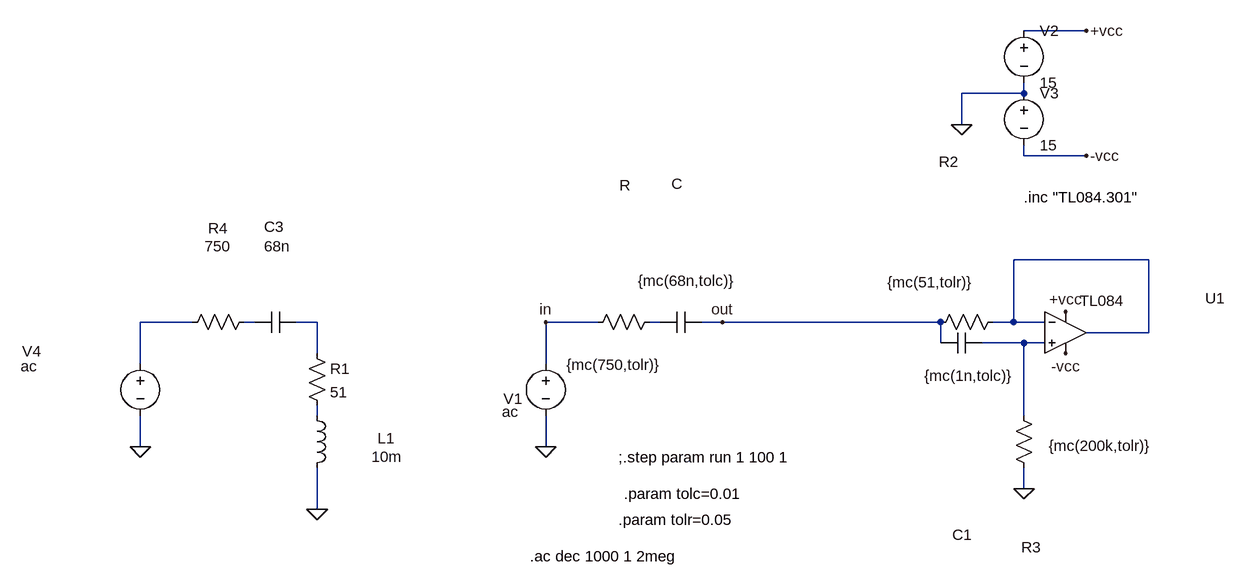
[diagram p0: schematic HP.asc]
HP.asc, the LTspice schematic file:
Version 4
SHEET 1 1036 680
WIRE 816 -368 720 -368
WIRE 720 -272 720 -288
WIRE 720 -272 624 -272
WIRE 624 -224 624 -272
WIRE 720 -176 720 -192
WIRE 816 -176 720 -176
WIRE 912 -16 704 -16
WIRE -560 80 -640 80
WIRE -464 80 -480 80
WIRE -368 80 -400 80
WIRE 64 80 -16 80
WIRE 160 80 144 80
WIRE 256 80 224 80
WIRE 592 80 256 80
WIRE 704 80 704 -16
WIRE 704 80 672 80
WIRE 752 80 704 80
WIRE 912 96 912 -16
WIRE 912 96 816 96
WIRE 592 112 592 80
WIRE 720 112 656 112
WIRE 752 112 720 112
WIRE -368 128 -368 80
WIRE -640 144 -640 80
WIRE -16 144 -16 80
WIRE -368 224 -368 208
WIRE 720 224 720 112
WIRE -640 272 -640 224
WIRE -16 272 -16 224
WIRE 720 336 720 304
WIRE -368 368 -368 304
FLAG -16 272 0
FLAG 816 -368 +vcc
FLAG 784 64 +vcc
FLAG 816 -176 -vcc
FLAG 784 128 -vcc
FLAG 624 -224 0
FLAG -16 80 in
FLAG 256 80 out
FLAG 720 336 0
FLAG -640 272 0
FLAG -368 368 0
SYMBOL Opamps\\opamp2 784 32 R0
WINDOW 0 215 11 Left 2
WINDOW 3 22 15 Left 2
SYMATTR InstName U1
SYMATTR Value TL084
SYMBOL voltage 720 -384 R0
SYMATTR InstName V2
SYMATTR Value 15
SYMBOL voltage 720 -288 R0
SYMATTR InstName V3
SYMATTR Value 15
SYMBOL voltage -16 128 R0
WINDOW 123 0 0 Left 0
WINDOW 39 0 0 Left 0
WINDOW 0 -65 70 Left 2
WINDOW 3 -67 90 Left 2
SYMATTR InstName V1
SYMATTR Value ac
SYMBOL res 160 64 R90
WINDOW 0 -179 54 VBottom 2
WINDOW 3 66 71 VTop 2
SYMATTR InstName R
SYMATTR Value {mc(750,tolr)}
SYMBOL cap 656 96 R90
WINDOW 0 327 31 VBottom 2
WINDOW 3 51 21 VTop 2
SYMATTR InstName C1
SYMATTR Value {mc(1n,tolc)}
SYMBOL res 688 64 R90
WINDOW 0 -215 84 VBottom 2
WINDOW 3 -61 112 VTop 2
SYMATTR InstName R2
SYMATTR Value {mc(51,tolr)}
SYMBOL res 704 208 R0
WINDOW 0 12 218 Left 2
WINDOW 3 54 62 Left 2
SYMATTR InstName R3
SYMATTR Value {mc(200k,tolr)}
SYMBOL cap 160 64 M90
WINDOW 0 -181 26 VBottom 2
WINDOW 3 -63 41 VTop 2
SYMATTR InstName C
SYMATTR Value {mc(68n,tolc)}
SYMBOL voltage -640 128 R0
WINDOW 123 0 0 Left 0
WINDOW 39 0 0 Left 0
WINDOW 0 -182 -3 Left 2
WINDOW 3 -184 20 Left 2
SYMATTR InstName V4
SYMATTR Value ac
SYMBOL res -464 64 R90
WINDOW 0 -113 56 VBottom 2
WINDOW 3 -116 57 VTop 2
SYMATTR InstName R4
SYMATTR Value 750
SYMBOL cap -464 64 M90
WINDOW 0 -115 30 VBottom 2
WINDOW 3 -116 35 VTop 2
SYMATTR InstName C3
SYMATTR Value 68n
SYMBOL ind -384 208 R0
WINDOW 0 109 51 Left 2
WINDOW 3 100 79 Left 2
SYMATTR InstName L1
SYMATTR Value 10m
SYMBOL res -384 112 R0
SYMATTR InstName R1
SYMATTR Value 51
TEXT -40 440 Left 2 !.ac dec 1000 1 2meg
TEXT 720 -112 Left 2 !.inc "TL084.301"
TEXT 96 288 Left 2 !;.step param run 1 100 1
TEXT 104 344 Left 2 !.param tolc=0.01
TEXT 96 384 Left 2 !.param tolr=0.05

The netlist it stands for:
* HP.asc
XU1 N006 N001 +vcc -vcc N001 TL084  ; pins In+ In- V+ V- OUT
V2 +vcc 0 15
V3 0 -vcc 15
V1 in 0 ac
R N005 in {mc(750,tolr)}
C1 N006 out {mc(1n,tolc)}
R2 N001 out {mc(51,tolr)}
R3 N006 0 {mc(200k,tolr)}
C N005 out {mc(68n,tolc)}
V4 N002 0 ac
R4 N003 N002 750
C3 N003 N004 68n
L1 N007 0 10m
R1 N004 N007 51
.ac dec 1000 1 2meg
.inc "TL084.301"
;.step param run 1 100 1
.param tolc=0.01
.param tolr=0.05
.backanno
.end